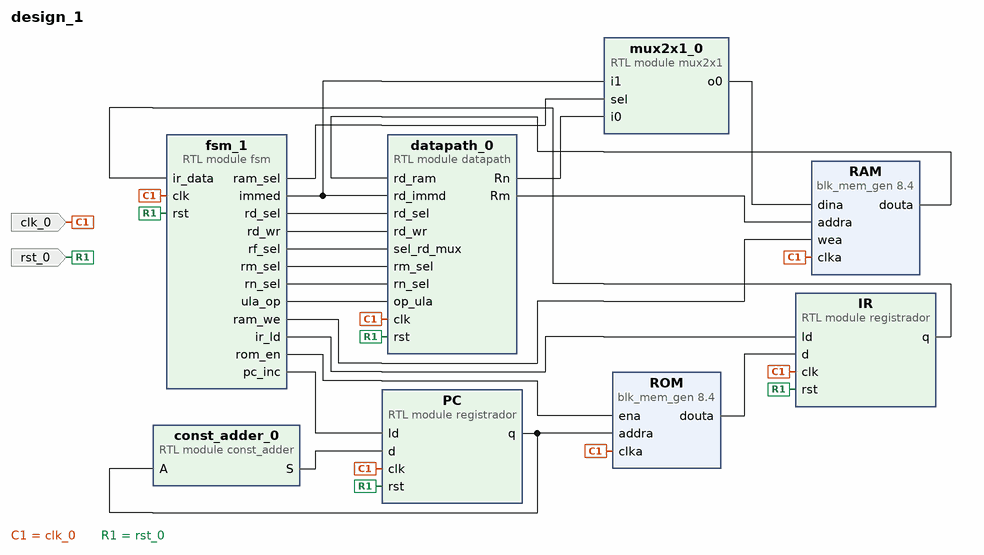
[diagram p0: block diagram of the top level]
# Vivado block design design_1, xc7z010clg400-1, Vivado 2025.1
create_bd_design design_1

create_bd_port -dir I -type clk clk_0
create_bd_port -dir I -type rst rst_0

create_bd_cell -type module -reference datapath datapath_0
create_bd_cell -type module -reference mux2x1 mux2x1_0
create_bd_cell -type module -reference registrador PC
create_bd_cell -type module -reference registrador IR
create_bd_cell -type module -reference const_adder const_adder_0
create_bd_cell -type ip -vlnv xilinx.com:ip:blk_mem_gen:8.4 ROM
set_property -dict [list \
  CONFIG.Enable_32bit_Address false \
  CONFIG.Memory_Type Single_Port_ROM \
  CONFIG.Port_A_Write_Rate 0 \
  CONFIG.Register_PortA_Output_of_Memory_Primitives true \
  CONFIG.Use_RSTA_Pin false \
  CONFIG.Write_Depth_A 65536 \
  CONFIG.Write_Width_A 16 \
  CONFIG.use_bram_block Stand_Alone \
] [get_bd_cells ROM]
create_bd_cell -type ip -vlnv xilinx.com:ip:blk_mem_gen:8.4 RAM
set_property -dict [list \
  CONFIG.Enable_32bit_Address false \
  CONFIG.Enable_A Always_Enabled \
  CONFIG.Read_Width_A 16 \
  CONFIG.Register_PortA_Output_of_Memory_Primitives true \
  CONFIG.Use_Byte_Write_Enable false \
  CONFIG.Use_RSTA_Pin false \
  CONFIG.Write_Depth_A 65536 \
  CONFIG.Write_Width_A 16 \
  CONFIG.use_bram_block Stand_Alone \
] [get_bd_cells RAM]
create_bd_cell -type module -reference fsm fsm_1

# ---- connections ----

connect_bd_net [get_bd_pins IR/q] [get_bd_pins fsm_1/ir_data]
connect_bd_net [get_bd_pins PC/q] [get_bd_pins const_adder_0/A] [get_bd_pins ROM/addra]
connect_bd_net [get_bd_pins RAM/douta] [get_bd_pins datapath_0/rd_ram]
connect_bd_net [get_bd_pins ROM/douta] [get_bd_pins IR/d]
connect_bd_net -net clk_0_1 [get_bd_ports clk_0] \
  [get_bd_pins IR/clk] [get_bd_pins PC/clk] [get_bd_pins ROM/clka] [get_bd_pins RAM/clka] [get_bd_pins datapath_0/clk] \
  [get_bd_pins fsm_1/clk]
connect_bd_net [get_bd_pins const_adder_0/S] [get_bd_pins PC/d]
connect_bd_net [get_bd_pins datapath_0/Rm] [get_bd_pins RAM/addra]
connect_bd_net [get_bd_pins datapath_0/Rn] [get_bd_pins mux2x1_0/i0]
connect_bd_net [get_bd_pins fsm_1/immed] [get_bd_pins mux2x1_0/i1] [get_bd_pins datapath_0/rd_immd]
connect_bd_net [get_bd_pins fsm_1/ir_ld] [get_bd_pins IR/ld]
connect_bd_net [get_bd_pins fsm_1/pc_inc] [get_bd_pins PC/ld]
connect_bd_net [get_bd_pins fsm_1/ram_sel] [get_bd_pins mux2x1_0/sel]
connect_bd_net [get_bd_pins fsm_1/ram_we] [get_bd_pins RAM/wea]
connect_bd_net [get_bd_pins fsm_1/rd_sel] [get_bd_pins datapath_0/rd_sel]
connect_bd_net [get_bd_pins fsm_1/rd_wr] [get_bd_pins datapath_0/rd_wr]
connect_bd_net [get_bd_pins fsm_1/rf_sel] [get_bd_pins datapath_0/sel_rd_mux]
connect_bd_net [get_bd_pins fsm_1/rm_sel] [get_bd_pins datapath_0/rm_sel]
connect_bd_net [get_bd_pins fsm_1/rn_sel] [get_bd_pins datapath_0/rn_sel]
connect_bd_net [get_bd_pins fsm_1/rom_en] [get_bd_pins ROM/ena]
connect_bd_net [get_bd_pins fsm_1/ula_op] [get_bd_pins datapath_0/op_ula]
connect_bd_net [get_bd_pins mux2x1_0/o0] [get_bd_pins RAM/dina]
connect_bd_net -net rst_0_1 [get_bd_ports rst_0] [get_bd_pins IR/rst] [get_bd_pins PC/rst] [get_bd_pins datapath_0/rst] [get_bd_pins fsm_1/rst]

validate_bd_design
save_bd_design
